# Altium schematic sheet ECG Amplifier.SchDoc
size A3; Organization: Altium Limited; Address1: 3 Minna Close; Address2: Belrose; Address3: NSW 2085; Address4: Australia
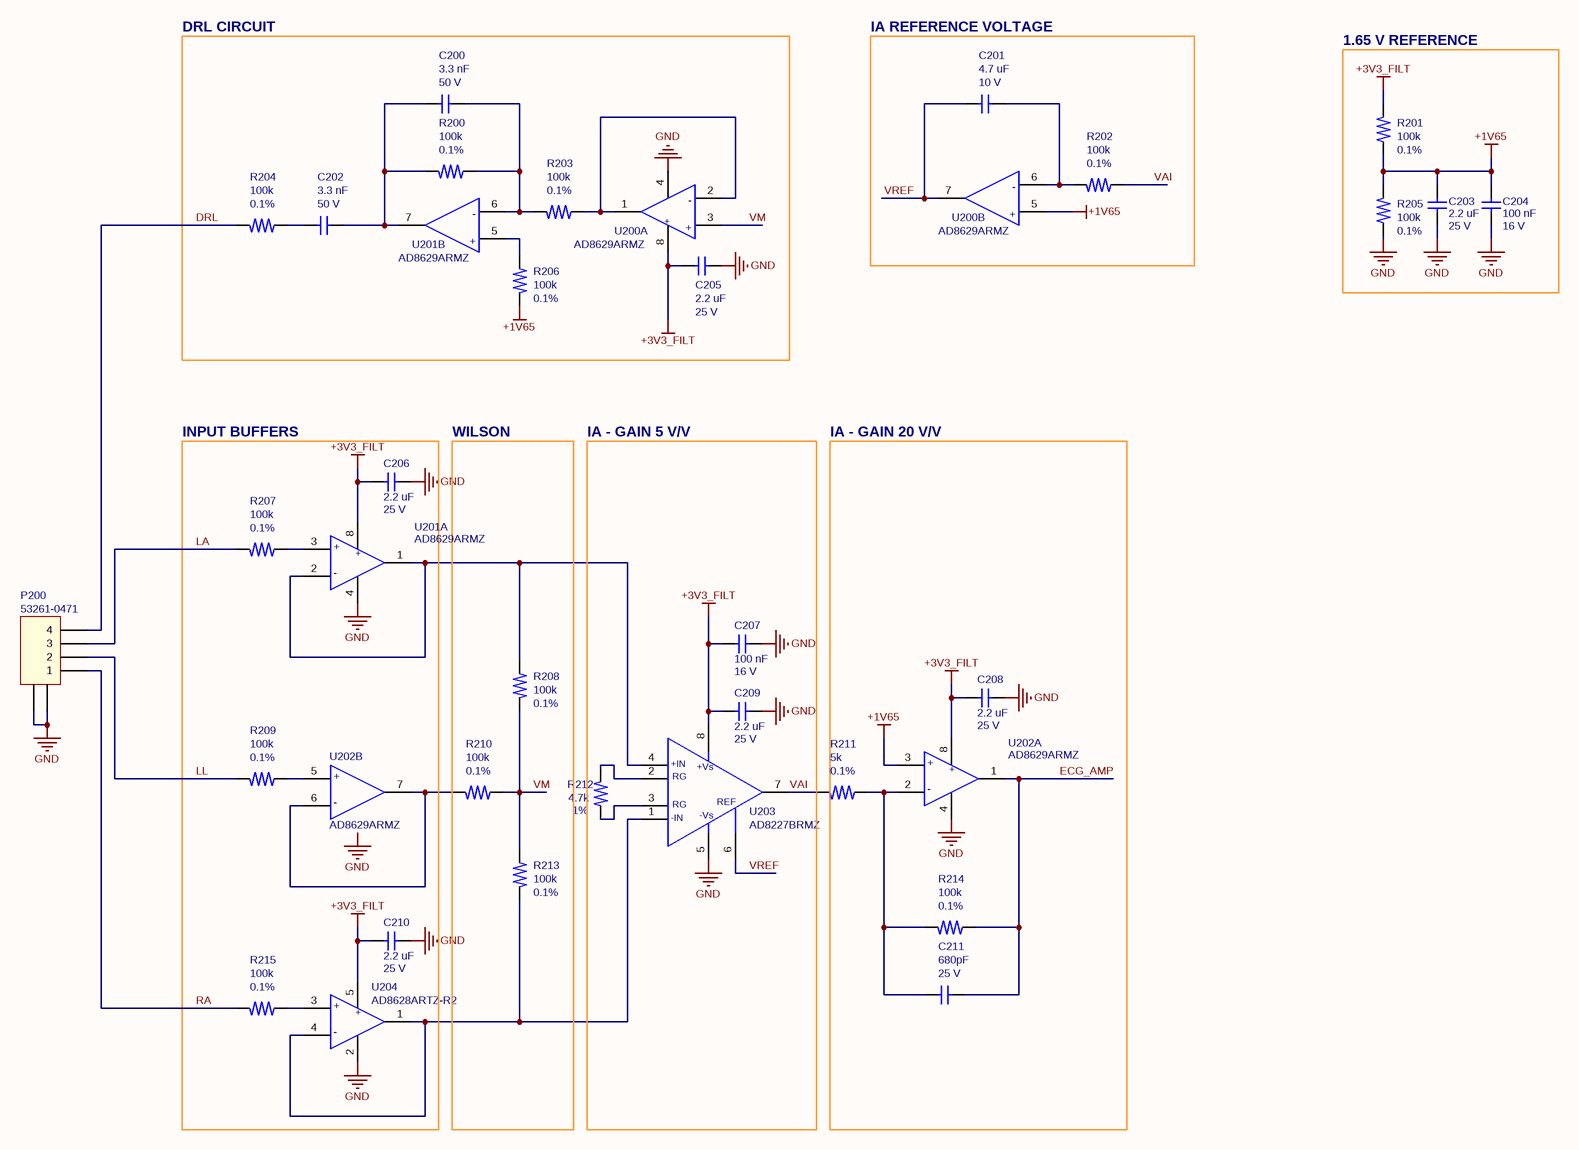
[diagram p0: ECG Amplifier.SchDoc]

## Parts
C200  value 3.3 nF  Voltage Max: 50 V  [C0402]  (hidden comment: Capacitor no polarized)
C201  value 4.7 uF  Voltage Max: 10 V  [C0402]  (hidden comment: Capacitor no polarized)
C202  value 3.3 nF  Voltage Max: 50 V  [C0402]  (hidden comment: Capacitor no polarized)
C203  value 2.2 uF  Voltage Max: 25 V  [C0402]  (hidden comment: Capacitor no polarized)
C204  value 100 nF  Voltage Max: 16 V  [C0402]  (hidden comment: Capacitor no polarized)
C205  value 2.2 uF  Voltage Max: 25 V  [C0402]  (hidden comment: Capacitor no polarized)
C206  value 2.2 uF  Voltage Max: 25 V  [C0402]  (hidden comment: Capacitor no polarized)
C207  value 100 nF  Voltage Max: 16 V  [C0402]  (hidden comment: Capacitor no polarized)
C208  value 2.2 uF  Voltage Max: 25 V  [C0402]  (hidden comment: Capacitor no polarized)
C209  value 2.2 uF  Voltage Max: 25 V  [C0402]  (hidden comment: Capacitor no polarized)
C210  value 2.2 uF  Voltage Max: 25 V  [C0402]  (hidden comment: Capacitor no polarized)
C211  value 680pF  Voltage Max: 25 V  [C0402]  (hidden comment: Capacitor no polarized)
P200  Reference: 53261-0471  [532610471]  (hidden comment: 532610471)
R200  value 100k  Tolerance: 0.1%  [R0402]  (hidden comment: R)
R201  value 100k  Tolerance: 0.1%  [R0402]  (hidden comment: R)
R202  value 100k  Tolerance: 0.1%  [R0402]  (hidden comment: R)
R203  value 100k  Tolerance: 0.1%  [R0402]  (hidden comment: R)
R204  value 100k  Tolerance: 0.1%  [R0402]  (hidden comment: R)
R205  value 100k  Tolerance: 0.1%  [R0402]  (hidden comment: R)
R206  value 100k  Tolerance: 0.1%  [R0402]  (hidden comment: R)
R207  value 100k  Tolerance: 0.1%  [R0402]  (hidden comment: R)
R208  value 100k  Tolerance: 0.1%  [R0402]  (hidden comment: R)
R209  value 100k  Tolerance: 0.1%  [R0402]  (hidden comment: R)
R210  value 100k  Tolerance: 0.1%  [R0402]  (hidden comment: R)
R211  value 5k  Tolerance: 0.1%  [R0402]  (hidden comment: R)
R212  value 4.7k  Tolerance: 1%  [R0402]  (hidden comment: R)
R213  value 100k  Tolerance: 0.1%  [R0402]  (hidden comment: R)
R214  value 100k  Tolerance: 0.1%  [R0402]  (hidden comment: R)
R215  value 100k  Tolerance: 0.1%  [R0402]  (hidden comment: R)
U200  AD8629ARMZ  [8-MSOP]  (parts A,B of 2)
U201  AD8629ARMZ  [8-MSOP]  (parts A,B of 2)
U202  AD8629ARMZ  [8-MSOP]  (parts A,B of 2)
U203  AD8227BRMZ  [8-MSOP]
U204  AD8628ARTZ-R2  [5-SOT-23]

## Blocks framed on the sheet
DRL CIRCUIT: C200 C202 C205 R200 R203 R204 R206 U200 U201
IA REFERENCE VOLTAGE: C201 R202 U200
1.65 V REFERENCE: C203 C204 R201 R205
INPUT BUFFERS: C206 C210 R207 R209 R215 U201 U202 U204
WILSON: R208 R210 R213
IA - GAIN 5 V/V: C207 C209 R212 U203
IA - GAIN 20 V/V: C208 C211 R211 R214 U202

## Nets
+1V65: C203.2 C204.2 R201.1 R205.2 R206.2 U200.5(+IN_B) U202.3(+IN_A)
+3V3_FILT: C205.2 C206.2 C207.2 C208.2 C209.2 C210.2 R201.2 U200.8(V+) U201.8(V+) U202.8(V+) U203.8(+Vs) U204.5(VP+)
GND: C203.1 C204.1 C205.1 C206.1 C207.1 C208.1 C209.1 C210.1 P200.0 R205.1 U200.4(V-) U201.4(V-) U202.4(V-) U203.5(-Vs) U204.2(Vs-)
DRL: P200.4 R204.2
ECG_AMP: C211.1 R214.1 U202.1(OUT_A)
LA: P200.3 R207.2
LL: P200.2 R209.2
RA: P200.1 R215.2
VAI: R202.1 R211.2 U203.7(OUT)
VM: R208.2 R210.1 R213.1 U200.3(+IN_A)
VREF: C201.2 U200.7(OUT_B) U203.6(REF)
NetC200_1: C200.1 R200.1 R203.2 U201.6(-IN_B)
NetC200_2: C200.2 C202.1 R200.2 U201.7(OUT_B)
NetC201_1: C201.1 R202.2 U200.6(-IN_B)
NetC202_2: C202.2 R204.1
NetC211_2: C211.2 R211.1 R214.2 U202.2(-IN_A)
NetR203_1: R203.1 U200.1(OUT_A) U200.2(-IN_A)
NetR206_1: R206.1 U201.5(+IN_B)
NetR207_1: R207.1 U201.3(+IN_A)
NetR208_1: R208.1 U201.1(OUT_A) U201.2(-IN_A) U203.4(+IN)
NetR209_1: R209.1 U202.5(+IN_B)
NetR210_2: R210.2 U202.6(-IN_B) U202.7(OUT_B)
NetR212_1: R212.1 U203.3(RG)
NetR212_2: R212.2 U203.2(RG)
NetR213_2: R213.2 U203.1(+IN) U204.1(Vout) U204.4(IN-)
NetR215_1: R215.1 U204.3(IN+)

## Notes on the sheet
- Labels drawn without touching a wire or pin: GND
- Title
- Size:
- Date:
- A4
- Number:
- Time:
- Revision:
- Sheet
- of
- File:
- (in symbol AD8227BRMZ) -IN
- (in symbol AD8628ARTZ-R2) +; -
- (in symbol AD8629ARMZ, part A) -; +
- (in symbol AD8629ARMZ, part B) -; +

## Library data of the parts
C200 C202 = Capacitor no polarized: Generic Capacitor; Manufacturer: Würth Elektronik; Dielectric: X7R; Tolerance: 10%; Reference: 885012206086; Current Max: *; Package: 0603; Package Description: *; Power Max: *; Supplier 1: Mouser; Supplier 2: Farnell; Supplier 3: Digikey; Supplier 1 Part Number: 710-885012206086; Supplier 2 Part Number: 2534046; Supplier 3 Part Number: 732-8004-1-ND; ESR: *; Voltage Min: *; Voltage Typ: *
C201 = Capacitor no polarized: Generic Capacitor; Manufacturer: Murata; Dielectric: X7R; Tolerance: 10%; Reference: GRM188Z71A475ME15D; Current Max: *; Package: 0603; Package Description: *; Power Max: *; Supplier 1: Mouser; Supplier 2: Farnell; Supplier 3: Digikey; Supplier 1 Part Number: 81-GRM188Z71A475ME5D; ESR: *; Voltage Min: *; Voltage Typ: *
C203 C205 C206 C208-C210 = Capacitor no polarized: Generic Capacitor; Manufacturer: TDK; Dielectric: X5R; Tolerance: 10%; Reference: C1608X5R1E225K080AE; Component URL: https://product.tdk.com/en/search/capacitor/ceramic/mlcc/info?part_no=C1608X5R0J156M080AC; Current Max: *; Package: 0603; Package Description: *; Power Max: *; Supplier 1: Mouser; Supplier 2: Farnell; Supplier 3: Digikey; Supplier 1 Part Number: 810-C1608X5R1E225KE; Supplier 2 Part Number: 3416103; Supplier 3 Part Number: 445-175226-1-ND; ESR: *; Voltage Min: *; Voltage Typ: *
C204 C207 = Capacitor no polarized: Generic Capacitor; Manufacturer: TDK; Dielectric: X5R; Tolerance: 10%; Reference: CGB3B3JB1C105K055AB; Component URL: https://product.tdk.com/en/search/capacitor/ceramic/mlcc/info?part_no=C1608X5R0J156M080AC; Current Max: *; Package: 0603; Package Description: *; Power Max: *; Supplier 1: Mouser; Supplier 2: Farnell; Supplier 3: Digikey; Supplier 1 Part Number: 810-CGB3B3JB1C105K0B; Supplier 3 Part Number: 445-13234-1-ND; ESR: *; Voltage Min: *; Voltage Typ: *
C211 = Capacitor no polarized: Generic Capacitor; Manufacturer: Würth Elektronik; Dielectric: C0G; Tolerance: 5%; Reference: 885012006043; Current Max: *; Package: 0603; Package Description: *; Power Max: *; Supplier 1: Mouser; Supplier 2: Farnell; Supplier 3: Digikey; Supplier 1 Part Number: 710-885012006043; Supplier 3 Part Number: 732-7785-1-ND; ESR: *; Voltage Min: *; Voltage Typ: *
P200 = 532610471: 1.25mm Pitch, PicoBlade PCB Header, Single Row, Right-Angle, Surface Mount, Tin (Sn) Plating, Friction Lock, 4 Circuits, Tape and Reel; Manufacturer: Molex; Current Max: 1.0 A; Voltage Max: 125.0 V; Component URL: https://www.molex.com/molex/products/part-detail/pcb_headers/0532610471; ESR: *; Footprint: *; Footprint Description: *; Power Max: *; Voltage Min: *; Voltage Typ: *; Supplier 1: Mouser; Supplier 2: Farnell; Supplier 3: Digikey; Supplier 1 Part Number: 538-53261-0471; Supplier 2 Part Number: 1125374; Supplier 3 Part Number: WM7622CT-ND
R200-R210 R213-R215 = R: Generic Resistor; Manufacturer: Welwyn Components / TT Electronics; Power Max: 0.0625 W; Reference: PCF0603R-100KBI; Voltage Max: 50 V; Component URL: *; Current Max: *; Dielectric: *; Package: 0603; Package Description: *; Supplier 1: Mouser; Supplier 2: Farnell; Supplier 3: Digikey; Supplier 1 Part Number: 756-PCF0603R100KBI; Supplier 2 Part Number: 1697402; Supplier 3 Part Number: *; Voltage Min: *; Voltage Typ: *; ESR: *
R211 = R: Generic Resistor; Manufacturer: Vishay / Thin Film; Power Max: 0.150 W; Reference: PNM0603E5001BST1; Voltage Max: 75 V; Component URL: *; Current Max: *; Dielectric: *; Package: 0603; Package Description: *; Supplier 1: Mouser; Supplier 2: Farnell; Supplier 3: Digikey; Supplier 1 Part Number: 71-PNM0603E5001BST1; Voltage Min: *; Voltage Typ: *; ESR: *
R212 = R: Generic Resistor; Manufacturer: Vishay / Draloric; Power Max: 0.0625 W; Reference: RCG04024K70FKED; Voltage Max: 50 V; Component URL: *; Current Max: *; Dielectric: *; Package: 0402; Package Description: *; Supplier 1: Mouser; Supplier 2: Farnell; Supplier 3: Digikey; Supplier 1 Part Number: 71-RCG04024K70FKED; Supplier 2 Part Number: *; Supplier 3 Part Number: *; Voltage Min: *; Voltage Typ: *; ESR: *
U200-U202 = AD8629ARMZ: Zero-Drift, Single-Supply, Rail-to-Rail  Input/Output Operational Amplifier; Manufacturer: Analog Devices; Voltage Max: 5.0 V; Voltage Min: 2.7 V; Component URL: https://www.analog.com/media/en/technical-documentation/data-sheets/AD8628_8629_8630.pdf; Current Max: *; ESR: *; Footprint Description: 8-Lead Mini Small Outline Package; Power Max: *; Supplier 1: Mouser; Supplier 2: Farnell; Supplier 3: Digikey; Supplier 1 Part Number: AD8629ARMZ; Supplier 2 Part Number: 2112572; Supplier 3 Part Number: AD8629ARMZ-REELCT-ND; Tolerance: *; Voltage Typ: *; Reference: AD8629ARMZ
U203 = AD8227BRMZ: Wide Supply Range, Rail-to-Rail  Output Instrumentation Amplifier; Manufacturer: Analog Devices; Current Max: 0.6 mA; Voltage Max: 36.0 V; Voltage Min: 2.2 V; Component URL: https://www.analog.com/media/en/technical-documentation/data-sheets/AD8227.pdf; ESR: *; Footprint Description: *; Power Max: *; Supplier 1: Mouser; Supplier 2: Farnell; Supplier 3: Digikey; Supplier 1 Part Number: 584-AD8227BRMZ; Supplier 2 Part Number: 2462028; Supplier 3 Part Number: AD8227BRMZ-ND; Tolerance: *; Value: *; Voltage Typ: *; Reference: AD8227BRMZ
U204 = AD8628ARTZ-R2: Zero-Drift, Single-Supply, Rail-to-Rail  Input/Output Operational Amplifier; Manufacturer: Analog Devices; Voltage Max: 5.0 V; Voltage Min: 2.5 V; Component URL: *; Current Max: *; ESR: *; Footprint Description: 5 Lead Small Outline Transistor 23; Power Max: *; Supplier 1: Mouser; Supplier 2: Farnell; Supplier 3: Digikey; Supplier 1 Part Number: *; Supplier 2 Part Number: *; Supplier 3 Part Number: *; Tolerance: *; Value: *; Voltage Typ: *; Reference: AD8628ARTZ-R2